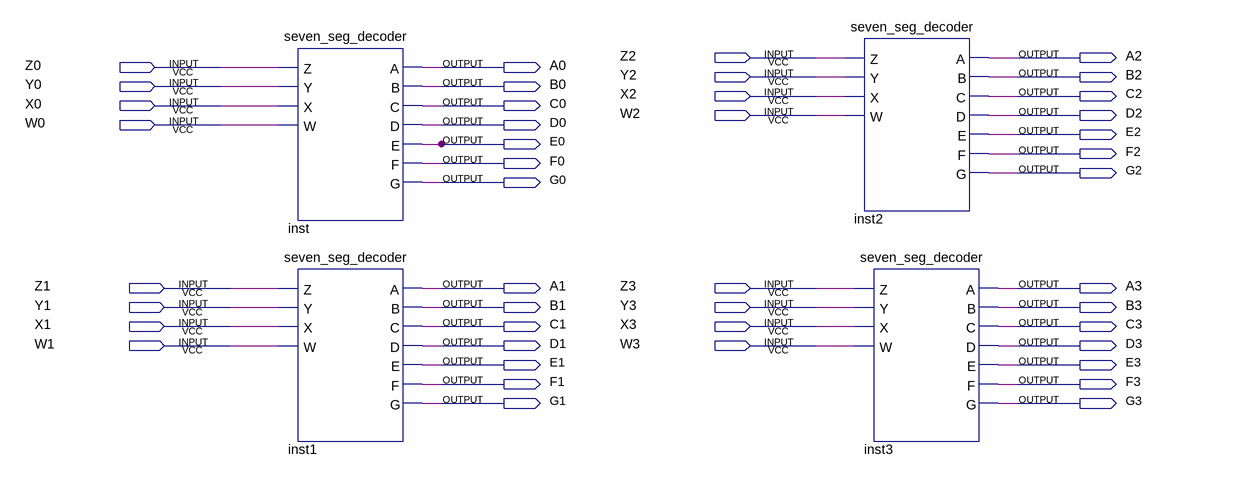
[diagram p0: schematic sheet]
// Quartus schematic lab5step1.bdf as structural Verilog: 4 symbols, 44 pins
module lab5step1 (
  input  Z2,
  input  Z0,
  input  Y2,
  input  Y0,
  input  X2,
  input  X0,
  input  W2,
  input  W0,
  input  Z1,
  input  Z3,
  input  Y1,
  input  Y3,
  input  X1,
  input  X3,
  input  W1,
  input  W3,
  output A2,
  output A0,
  output B2,
  output B0,
  output C2,
  output C0,
  output D2,
  output D0,
  output E2,
  output E0,
  output F2,
  output F0,
  output G2,
  output G0,
  output A1,
  output A3,
  output B1,
  output B3,
  output C1,
  output C3,
  output D1,
  output D3,
  output E1,
  output E3,
  output F1,
  output F3,
  output G1,
  output G3
);

  seven_seg_decoder inst (.Z(Z0), .Y(Y0), .X(X0), .W(W0), .A(A0), .B(B0), .C(C0), .D(D0), .E(E0), .F(F0), .G(G0));
  seven_seg_decoder inst1 (.Z(Z1), .Y(Y1), .X(X1), .W(W1), .A(A1), .B(B1), .C(C1), .D(D1), .E(E1), .F(F1), .G(G1));
  seven_seg_decoder inst2 (.Z(Z2), .Y(Y2), .X(X2), .W(W2), .A(A2), .B(B2), .C(C2), .D(D2), .E(E2), .F(F2), .G(G2));
  seven_seg_decoder inst3 (.Z(Z3), .Y(Y3), .X(X3), .W(W3), .A(A3), .B(B3), .C(C3), .D(D3), .E(E3), .F(F3), .G(G3));
endmodule
